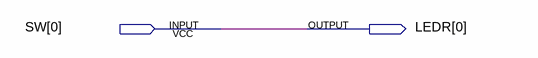
[diagram p0: schematic sheet]
// Quartus schematic helloworld.bdf as structural Verilog: 0 symbols, 2 pins
module helloworld (
  input  [0:0] SW,
  output [0:0] LEDR
);


  assign LEDR[0] = SW[0];
endmodule
